# Altium schematic sheet MAINSCHEMATIC.SchDoc
size A
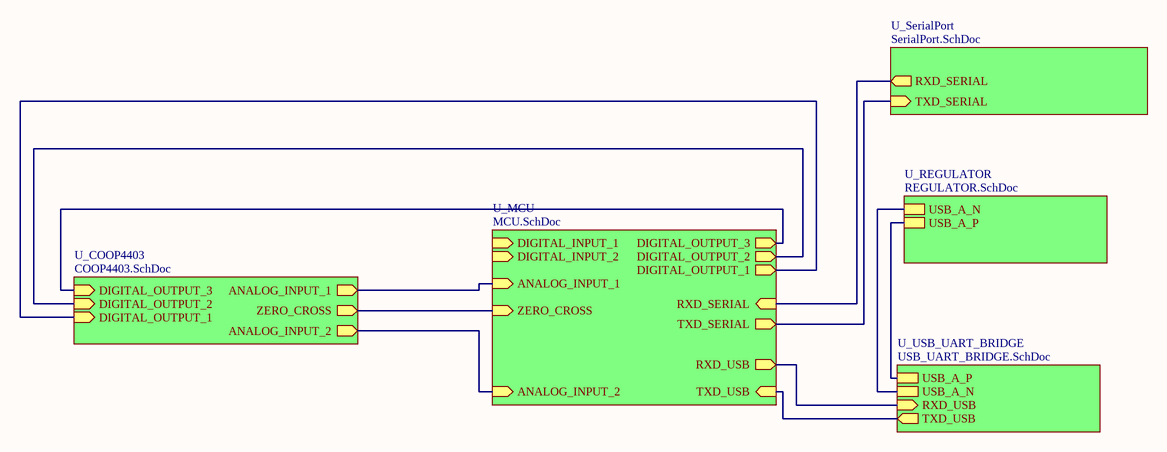
[diagram p0: MAINSCHEMATIC.SchDoc]

## Sub-sheets
U_COOP4403 = COOP4403.SchDoc: ANALOG_INPUT_2 (out), ANALOG_INPUT_1 (out), DIGITAL_OUTPUT_2 (in), DIGITAL_OUTPUT_1 (in), DIGITAL_OUTPUT_3 (in), ZERO_CROSS (out)
U_MCU = MCU.SchDoc: DIGITAL_OUTPUT_3 (out), DIGITAL_OUTPUT_2 (out), DIGITAL_OUTPUT_1 (out), DIGITAL_INPUT_1 (in), DIGITAL_INPUT_2 (in), RXD_USB (out), TXD_USB (in), ANALOG_INPUT_1 (in), ANALOG_INPUT_2 (in), ZERO_CROSS (in), TXD_SERIAL (out), RXD_SERIAL (in)
U_REGULATOR = REGULATOR.SchDoc: USB_A_N, USB_A_P
U_SerialPort = SerialPort.SchDoc: RXD_SERIAL (out), TXD_SERIAL (in)
U_USB_UART_BRIDGE = USB_UART_BRIDGE.SchDoc: USB_A_N, USB_A_P, TXD_USB (out), RXD_USB (in)

## Nets
(unnamed): sheet U_COOP4403/ANALOG_INPUT_2, sheet U_MCU/ANALOG_INPUT_2
(unnamed): sheet U_COOP4403/ANALOG_INPUT_1, sheet U_MCU/ANALOG_INPUT_1
(unnamed): sheet U_COOP4403/DIGITAL_OUTPUT_2, sheet U_MCU/DIGITAL_OUTPUT_2
(unnamed): sheet U_COOP4403/DIGITAL_OUTPUT_1, sheet U_MCU/DIGITAL_OUTPUT_1
(unnamed): sheet U_COOP4403/DIGITAL_OUTPUT_3, sheet U_MCU/DIGITAL_OUTPUT_3
(unnamed): sheet U_COOP4403/ZERO_CROSS, sheet U_MCU/ZERO_CROSS
(unnamed): sheet U_MCU/RXD_USB, sheet U_USB_UART_BRIDGE/RXD_USB
(unnamed): sheet U_MCU/TXD_USB, sheet U_USB_UART_BRIDGE/TXD_USB
(unnamed): sheet U_MCU/TXD_SERIAL, sheet U_SerialPort/TXD_SERIAL
(unnamed): sheet U_MCU/RXD_SERIAL, sheet U_SerialPort/RXD_SERIAL
(unnamed): sheet U_REGULATOR/USB_A_N, sheet U_USB_UART_BRIDGE/USB_A_N
(unnamed): sheet U_REGULATOR/USB_A_P, sheet U_USB_UART_BRIDGE/USB_A_P